# Altium project ZRX.PrjPcb
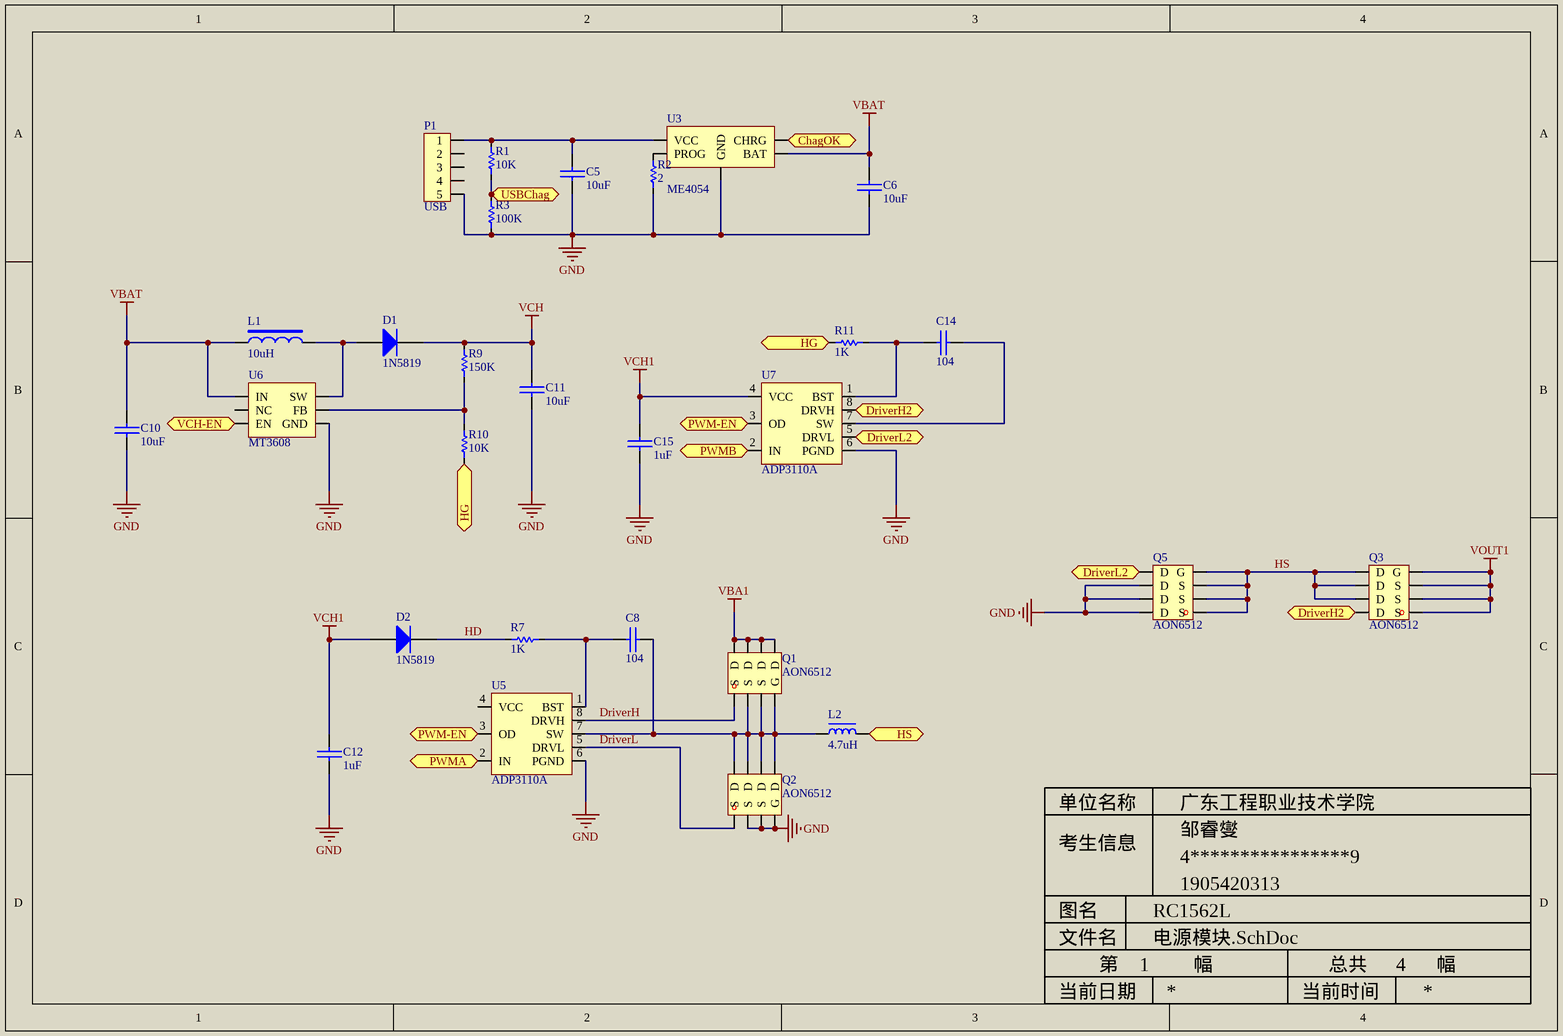
[diagram p0: 电源模块.SchDoc]
4 sheets, 64 parts. Net scope: flat (ports and power ports of the same name join across sheets).
Board file: zrxpcb.PcbDoc
Sheets:
  电源模块.SchDoc
  主控模块.SchDoc
  输入模块.SchDoc
  显示模块.SchDoc

## Sheet 电源模块.SchDoc: RC1562L
size A4; Organization: 广东工程职业技术学院; Address1: 邹睿燮; Address2: 4****************9; Address3: 1905420313; SheetNumber: 1; SheetTotal: 4

### Parts
C5  10uF  [6-0805_L]
C6  10uF  [6-0805_L]
C8  104  [6-0805_L]
C10  10uF  [6-0805_L]
C11  10uF  [6-0805_L]
C12  1uF  [6-0805_L]
C14  104  [6-0805_L]
C15  1uF  [6-0805_L]
D1  1N5819  [DO-41]
D2  1N5819  [DO-41]
L1  10uH  [CD32]
L2  4.7uH  [IND12_12]
P1  USB  [M-USB-V]
Q1  AON6512  [SON5_6mm]
Q2  AON6512  [SON5_6mm]
Q3  AON6512  [SON5_6mm]
Q5  AON6512  [SON5_6mm]
R1  10K  [6-0805_L]
R2  2  [6-0805_L]
R3  100K  [6-0805_L]
R7  1K  [6-0805_L]
R9  150K  [6-0805_L]
R10  10K  [6-0805_L]
R11  1K  [6-0805_L]
U3  ME4054  [SOT23-5]
U5  ADP3110A  [ADP3110A]
U6  MT3608  [SOT-23-6]
U7  ADP3110A  [ADP3110A]

### Ports
ChagOK, DriverH2, DriverL2, HG, HS, PWM-EN, PWMA, PWMB, USBChag, VCH-EN

### Nets
GND: C5.1 C6.1 C10.2 C11.1 C12.1 C15.1 P1.5 Q2.2(S) Q2.3(S) Q2.4(G) Q5.6(D) Q5.7(D) Q5.8(D) R2.1 R3.1 U3.2(GND) U5.6(PGND) U6.2(GND) U7.6(PGND)
VBA1: Q1.5(D) Q1.6(D) Q1.7(D) Q1.8(D)
VBAT: C6.2 C10.1 L1.1 U3.3(BAT) U6.5(IN)
VCH: C11.2 D1.2(K) R9.2
VCH1: C12.2 C15.2 D2.1(A) U7.4(VCC)
VOUT1: Q3.1(S) Q3.2(S) Q3.3(S) Q3.4(G)
DriverH: Q1.1(S) U5.8(DRVH)
DriverL: Q2.1(S) U5.5(DRVL)
HD: D2.2(K) R7.2
HS: Q3.5(D) Q3.6(D) Q3.7(D) Q5.1(S) Q5.2(S) Q5.3(S) Q5.4(G)
NetC5_2: C5.2 P1.1 R1.2 U3.4(VCC)
NetC8_1: C8.1 R7.1 U5.1(BST)
NetC8_2: C8.2 L2.1 Q1.2(S) Q1.3(S) Q1.4(G) Q2.5(D) Q2.6(D) Q2.7(D) Q2.8(D) U5.7(SW)
NetC14_1: C14.1 R11.1 U7.1(BST)
NetC14_2: C14.2 U7.7(SW)
NetC24_2: U6.4(EN) ; port VCH-EN
NetD1_1: D1.1(A) L1.2 U6.1(SW)
NetL2_2: L2.2 ; port HS
NetQ3_8: Q3.8(D) U7.8(DRVH) ; port DriverH2
NetQ5_5: Q5.5(D) U7.5(DRVL) ; port DriverL2
NetR1_1: R1.1 R3.2 ; port USBChag
NetR2_2: R2.2 U3.5(PROG)
NetR9_1: R9.1 R10.2 U6.3(FB)
NetR10_1: R10.1 R11.2 ; port HG
NetU1_3: U5.2(IN) ; port PWMA
NetU1_4: U7.2(IN) ; port PWMB
NetU1_18: U5.3(OD) U7.3(OD) ; port PWM-EN
NetU1_21: U3.1(CHRG) ; port ChagOK

Not connected (* = marked no-connect by the designer): P1 2 3 4; U5 4(VCC); U6 6(NC)

### Notes on the sheet
- 单位名称
- 考生信息
- 图名
- 文件名
- 第
- 幅
- 总共
- 当前日期
- 当前时间

### Library data of the parts
C5 C6 C8 C10-C12 C14 C15 = CAP: Capacitor
D1 D2 = Diode 1N4001: 1 Amp General Purpose Rectifier; Published: 8-Jun-2000; LatestRevisionDate: 17-Jul-2002; LatestRevisionNote: Re-released for DXP Platform.; DatasheetVersion: 1998; PackageVersion: Aug-1999; PackageReference: DO-41; Publisher: Altium Limited; PackageDescription: Diode, Axial; Body 5.2 x 2.7 mm (LxDia. max), Lead Dia. 0.86 mm (max); Code_JEDEC: DO-204-AL; ComponentLink1Description: Manufacturer Link; ComponentLink1URL: http://www.fairchildsemi.com/; ComponentLink2Description: Datasheet; ComponentLink2URL: http://www.fairchildsemi.com/ds/1N%2F1N4001.pdf
L1 = INDUCTOR2
L2 = INDUCTOR
P1 = 5 PIN CONNECTOR
Q1-Q3 Q5 = MOS: Singe 8pin; WSD3030DS: WSD3030DS; SI4477: SI4477; NCE3035Q: NCE3035Q
R1-R3 R7 R9-R11 = Res1_1: Resistor; Published: 8-Jun-2000; LatestRevisionDate: 17-Jul-2002; LatestRevisionNote: Re-released for DXP Platform.; PackageReference: AXIAL-0.3; Publisher: Altium Limited; PackageDescription: Axial Device, Thru-Hole; 2 Leads; 0.3 in Pin Spacing

## Sheet 主控模块.SchDoc: RC1562L
size A4; Organization: 广东工程职业技术学院; Address1: 邹睿燮; Address2: 4****************9; Address3: 1905420313; SheetNumber: 2; SheetTotal: 4
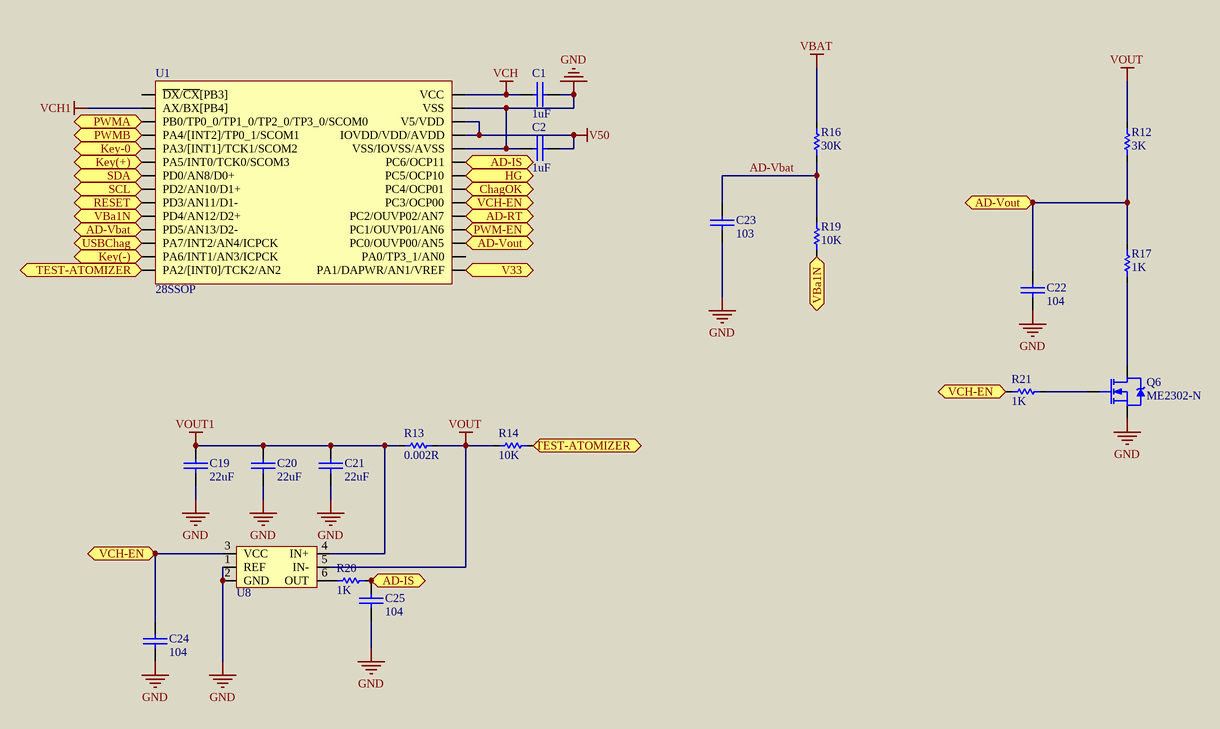
[diagram p1: 主控模块.SchDoc]

### Parts
C1  1uF  [6-0805_L]
C2  1uF  [6-0805_L]
C19  22uF  [6-0805_L]
C20  22uF  [6-0805_L]
C21  22uF  [6-0805_L]
C22  104  [6-0805_L]
C23  103  [6-0805_L]
C24  104  [6-0805_L]
C25  104  [6-0805_L]
Q6  ME2302-N  [SOT-23]
R12  3K  [6-0805_L]
R13  0.002R  [6-0805_L]
R14  10K  [6-0805_L]
R16  30K  [6-0805_L]
R17  1K  [6-0805_L]
R19  10K  [6-0805_L]
R20  1K  [6-0805_L]
R21  1K  [6-0805_L]
U1  28SSOP  [28SSOP]
U8  INA199  [SC70-6]  (value not drawn)

### Ports
AD-IS, AD-RT, AD-Vbat, AD-Vout, ChagOK, HG, Key(+), Key(-), Key-0, PWM-EN, PWMA, PWMB, RESET, SCL, SDA, TEST-ATOMIZER, USBChag, V33, VBa1N, VCH-EN

### Nets
GND: C1.2 C2.1 C19.1 C20.1 C21.1 C22.1 C23.1 C24.1 C25.1 Q6.2(S) U1.24(VSS/IOVSS/AVSS) U1.27(VSS) U8.1(REF) U8.2(GND)
V50: C2.2 U1.25(IOVDD/VDD/AVDD) U1.26(V5/VDD)
VBAT: R16.2
VCH: C1.1 U1.28(VCC)
VCH1: U1.2(AX/BX[PB4])
VOUT: R12.2 R13.2 R14.1 U8.5(IN-)
VOUT1: C19.2 C20.2 C21.2 R13.1 U8.4(IN+)
AD-Vbat: C23.2 R16.1 R19.2
NetC22_2: C22.2 R12.1 R17.2 U1.17(PC0/OUVP00/AN5) ; port AD-Vout
NetC24_2: C24.2 R21.1 U1.20(PC3/OCP00) U8.3(VCC) ; port VCH-EN
NetC25_2: C25.2 R20.2 U1.23(PC6/OCP11) ; port AD-IS
NetK2_2: U1.13(PA6/INT1/AN3/ICPCK) ; port Key(-)
NetK3_2: U1.6(PA5/INT0/TCK0/SCOM3) ; port Key(+)
NetQ6_1: Q6.1(G) R21.2
NetQ6_3: Q6.3(D) R17.1
NetR1_1: U1.12(PA7/INT2/AN4/ICPCK) ; port USBChag
NetR10_1: U1.22(PC5/OCP10) ; port HG
NetR14_2: R14.2 U1.14(PA2/[INT0]/TCK2/AN2) ; port TEST-ATOMIZER
NetR15_1: U1.19(PC2/OUVP02/AN7) ; port AD-RT
NetR19_1: R19.1 U1.10(PD4/AN12/D2+) ; port VBa1N
NetR20_1: R20.1 U8.6(OUT)
NetU1_3: U1.3(PB0/TP0_0/TP1_0/TP2_0/TP3_0/SCOM0) ; port PWMA
NetU1_4: U1.4(PA4/[INT2]/TP0_1/SCOM1) ; port PWMB
NetU1_5: U1.5(PA3/[INT1]/TCK1/SCOM2) ; port Key-0
NetU1_7: U1.7(PD0/AN8/D0+) ; port SDA
NetU1_8: U1.8(PD2/AN10/D1+) ; port SCL
NetU1_9: U1.9(PD3/AN11/D1-) ; port RESET
NetU1_11: U1.11(PD5/AN13/D2-) ; port AD-Vbat
NetU1_15: U1.15(PA1/DAPWR/AN1/VREF) ; port V33
NetU1_18: U1.18(PC1/OUVP01/AN6) ; port PWM-EN
NetU1_21: U1.21(PC4/OCP01) ; port ChagOK

Not connected (* = marked no-connect by the designer): U1 1(~{DX}/~{CX}[PB3]) 16(PA0/TP3_1/AN0)

### Notes on the sheet
- 单位名称
- 考生信息
- 图名
- 文件名
- 第
- 幅
- 总共
- 当前日期
- 当前时间

### Library data of the parts
C1 C2 C19-C25 = CAP: Capacitor
Q6 = NMOS-2: N-Channel Power MOSFET; Note: Pin 2 is electrically connected to pin 4.; Published: 8-Jun-2000; LatestRevisionDate: 17-Jul-2002; LatestRevisionNote: Re-released for DXP Platform.; DatasheetVersion: PD-9.814; PackageVersion: Feb-1997; PackageReference: TO-220AB; Publisher: Altium Limited; PackageDescription: TO, Thru-Hole, Vertical, Heatsink Mounted; 3 In-Line Leads; Pitch 2.54 mm; ComponentLink1Description: Manufacturer Link; ComponentLink1URL: http://www.irf.com/
R12-R14 R16 R17 R19-R21 = Res1_1: Resistor; Published: 8-Jun-2000; LatestRevisionDate: 17-Jul-2002; LatestRevisionNote: Re-released for DXP Platform.; PackageReference: AXIAL-0.3; Publisher: Altium Limited; PackageDescription: Axial Device, Thru-Hole; 2 Leads; 0.3 in Pin Spacing
U1 = HT45HF4N

## Sheet 输入模块.SchDoc: RC1562L
size A4; Organization: 广东工程职业技术学院; Address1: 邹睿燮; Address2: 4****************9; Address3: 1905420313; SheetNumber: 3; SheetTotal: 4
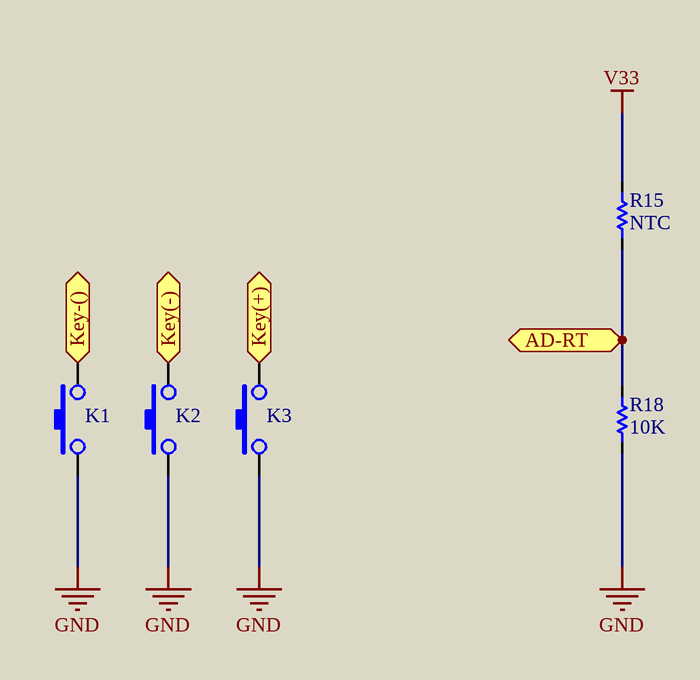
[diagram p2: 输入模块.SchDoc]

### Parts
K1  SW-PB  [4KEY_SMT]  (value not drawn)
K2  SW-PB  [4KEY_SMT]  (value not drawn)
K3  SW-PB  [4KEY_SMT]  (value not drawn)
R15  NTC  [6-0805_L]
R18  10K  [6-0805_L]

### Ports
AD-RT, Key(+), Key(-), Key-()

### Nets
GND: K1.1 K2.1 K3.1 R18.1
V33: R15.2
NetK1_2: K1.2 ; port Key-()
NetK2_2: K2.2 ; port Key(-)
NetK3_2: K3.2 ; port Key(+)
NetR15_1: R15.1 R18.2 ; port AD-RT

### Notes on the sheet
- 单位名称
- 考生信息
- 图名
- 文件名
- 第
- 幅
- 总共
- 当前日期
- 当前时间

### Library data of the parts
R15 R18 = Res1_1: Resistor; Published: 8-Jun-2000; LatestRevisionDate: 17-Jul-2002; LatestRevisionNote: Re-released for DXP Platform.; PackageReference: AXIAL-0.3; Publisher: Altium Limited; PackageDescription: Axial Device, Thru-Hole; 2 Leads; 0.3 in Pin Spacing

## Sheet 显示模块.SchDoc: RC1562L
size A4; Organization: 广东工程职业技术学院; Address1: 邹睿燮; Address2: 4****************9; Address3: 1905420313; SheetNumber: 4; SheetTotal: 4
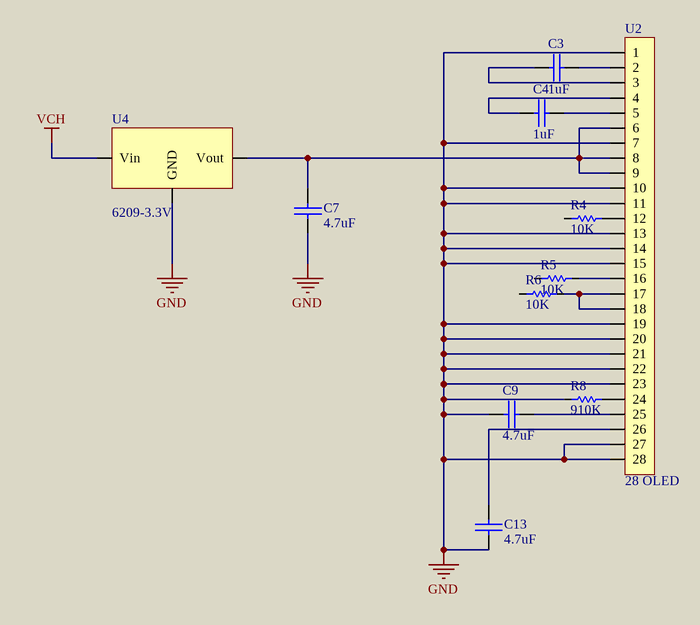
[diagram p3: 显示模块.SchDoc]

### Parts
C3  1uF  [6-0805_L]
C4  1uF  [6-0805_L]
C7  4.7uF  [6-0805_L]
C9  4.7uF  [6-0805_L]
C13  4.7uF  [6-0805_L]
R4  10K  [6-0805_L]
R5  10K  [6-0805_L]
R6  10K  [6-0805_L]
R8  910K  [6-0805_L]
U2  28 OLED  [28OLED]
U4  6209-3.3V  [SOT-23]

### Nets
GND: C7.1 C9.2 C13.2 R8.1 U2.1 U2.7 U2.10 U2.11 U2.13 U2.14 U2.15 U2.19 U2.20 U2.21 U2.22 U2.23 U2.27 U2.28 U4.1(GND)
VCH: U4.3(Vin)
NetC3_1: C3.1 U2.3
NetC3_2: C3.2 U2.2
NetC4_1: C4.1 U2.4
NetC4_2: C4.2 U2.5
NetC7_2: C7.2 U2.6 U2.8 U2.9 U4.2(Vout)
NetC9_1: C9.1 U2.25
NetC13_1: C13.1 U2.26
NetR4_2: R4.2 U2.12
NetR5_2: R5.2 U2.16
NetR6_2: R6.2 U2.17 U2.18
NetR8_2: R8.2 U2.24

Not connected (* = marked no-connect by the designer): R4 1; R5 1; R6 1

### Notes on the sheet
- 单位名称
- 考生信息
- 图名
- 文件名
- 第
- 幅
- 总共
- 当前日期
- 当前时间

### Library data of the parts
C3 C4 C7 C9 C13 = CAP: Capacitor
R4-R6 R8 = Res1_1: Resistor; Published: 8-Jun-2000; LatestRevisionDate: 17-Jul-2002; LatestRevisionNote: Re-released for DXP Platform.; PackageReference: AXIAL-0.3; Publisher: Altium Limited; PackageDescription: Axial Device, Thru-Hole; 2 Leads; 0.3 in Pin Spacing
U2 = 28OLED
U4 = LDO

## Nets that join several sheets
GND: 电源模块 (19 pins), 主控模块 (14 pins), 输入模块 (K1.1 K2.1 K3.1 R18.1), 显示模块 (19 pins)
VBAT: 电源模块 (5 pins), 主控模块 (R16.2)
VCH: 电源模块 (C11.2 D1.2 R9.2), 主控模块 (C1.1 U1.28), 显示模块 (U4.3)
VCH1: 电源模块 (C12.2 C15.2 D2.1 U7.4), 主控模块 (U1.2)
VOUT1: 电源模块 (Q3.1 Q3.2 Q3.3 Q3.4), 主控模块 (5 pins)
NetC24_2: 电源模块 (U6.4), 主控模块 (C24.2 R21.1 U1.20 U8.3)
NetK2_2: 主控模块 (U1.13), 输入模块 (K2.2)
NetK3_2: 主控模块 (U1.6), 输入模块 (K3.2)
NetR1_1: 电源模块 (R1.1 R3.2), 主控模块 (U1.12)
NetR10_1: 电源模块 (R10.1 R11.2), 主控模块 (U1.22)
NetR15_1: 主控模块 (U1.19), 输入模块 (R15.1 R18.2)
NetU1_3: 电源模块 (U5.2), 主控模块 (U1.3)
NetU1_4: 电源模块 (U7.2), 主控模块 (U1.4)
NetU1_18: 电源模块 (U5.3 U7.3), 主控模块 (U1.18)
NetU1_21: 电源模块 (U3.1), 主控模块 (U1.21)